# EAGLE design SONOff (EAGLE 7.6.0)
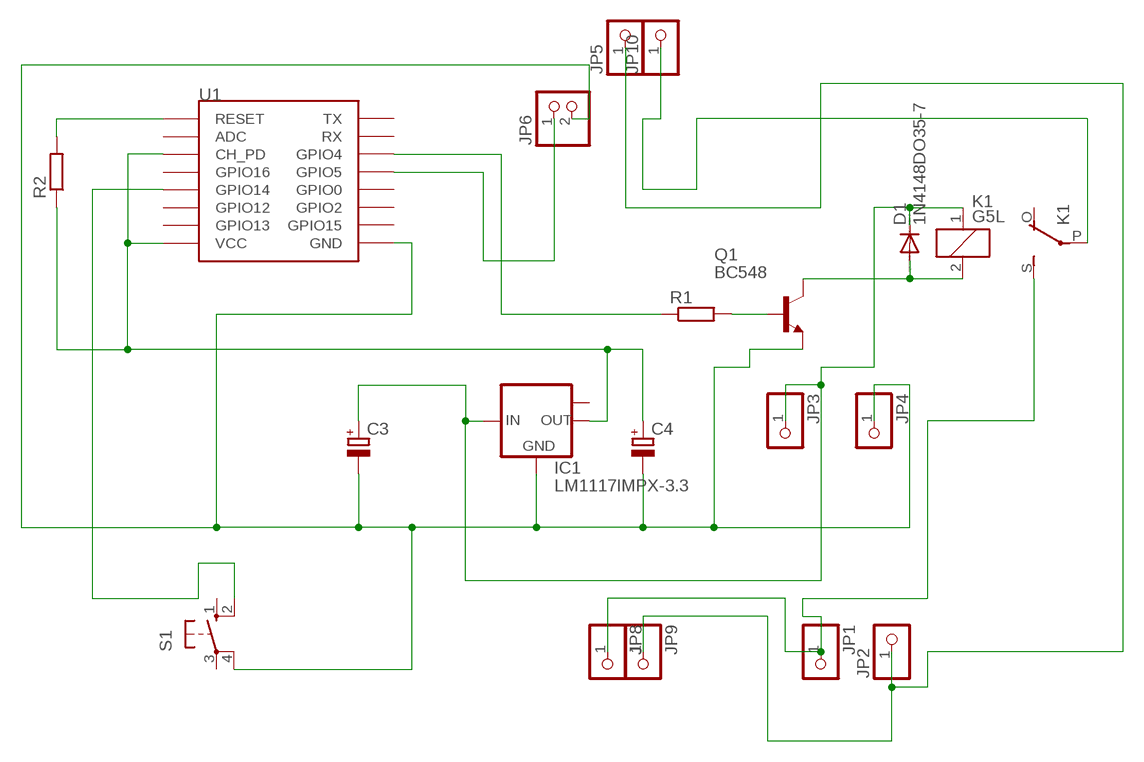
[diagram p0: schematic, sheet 1]

## Parts
C3  CPOL-EUE3.5-8  [E3,5-8]
C4  CPOL-EUE2.5-5  [E2,5-5]
D1  1N4148DO35-7  [DO35-7]
IC1  LM1117IMPX-3.3  [SOT223]
JP1  PINHD-1X1  [1X01]
JP2  PINHD-1X1  [1X01]
JP3  PINHD-1X1  [1X01]
JP4  PINHD-1X1  [1X01]
JP5  PINHD-1X1  [1X01]
JP6  PINHD-1X2  [1X02]
JP8  PINHD-1X1  [1X01]
JP9  PINHD-1X1  [1X01]
JP10  PINHD-1X1  [1X01]
K1  G5L  [G5LE]
Q1  BC548  [TO92-EBC]
R1  R-EU_0207/10  [0207/10]
R2  R-EU_0207/10  [0207/10]
S1  10-XX  [B3F-10XX]
U1  ESP12SMD  [ESP12-SMD]

## Nets
N$1: R1.1 U1.GPIO4
N$2: Q1.B R1.2
N$3: D1.A K1.2 Q1.C
N$4: C3.+ D1.C IC1.3(IN) JP3.1 K1.1
N$5: JP1.1 JP8.1 K1.S(2:S)
N$6: C4.+ IC1.2(OUT) R2.1 U1.CH_PD U1.VCC
N$7: JP2.1 JP5.1 JP9.1
N$9: JP6.1 U1.GPIO5
N$10: S1.2(S1) U1.GPIO14
N$11: R2.2 U1.RESET
N$12: C3.- C4.- IC1.1(GND) JP4.1 JP6.2 Q1.E S1.4(P1) U1.GND
SAIDA: JP10.1 K1.P(2:P)
Unconnected: IC1.TAB(OUT1) K1.O(2:O) S1.1(S) S1.3(P) U1.ADC U1.GPIO0 U1.GPIO2 U1.GPIO12 U1.GPIO13 U1.GPIO15 U1.GPIO16 U1.RXD0(RX) U1.TXD0(TX)

## Library data of the parts
C3 C4 = rcl:CPOL-EU: POLARIZED CAPACITOR, European symbol
D1 = diode:1N4148: DIODE high speed (Philips)
IC1 = lm1117:LM1117IMPX-*
JP1-JP5 JP8-JP10 = pinhead:PINHD-1X1: PIN HEADER
JP6 = pinhead:PINHD-1X2: PIN HEADER
K1 = relay:G5L: RELAY 1 x switch, 10 A/120 V AC, 8 A/30 V ADC, Omron; OC_FARNELL: unknown; OC_NEWARK: unknown
Q1 = transistor-npn:BC548*: NPN Transistor
R1 R2 = resistor:R-EU_: RESISTOR, European symbol
S1 = switch-omron:10-XX: OMRON SWITCH; MPN: B3F-1000; OC_FARNELL: 176432; OC_NEWARK: 36M3542
U1 = esp8266modules:ESP12: ESP8266 Wifi module 12

## Board
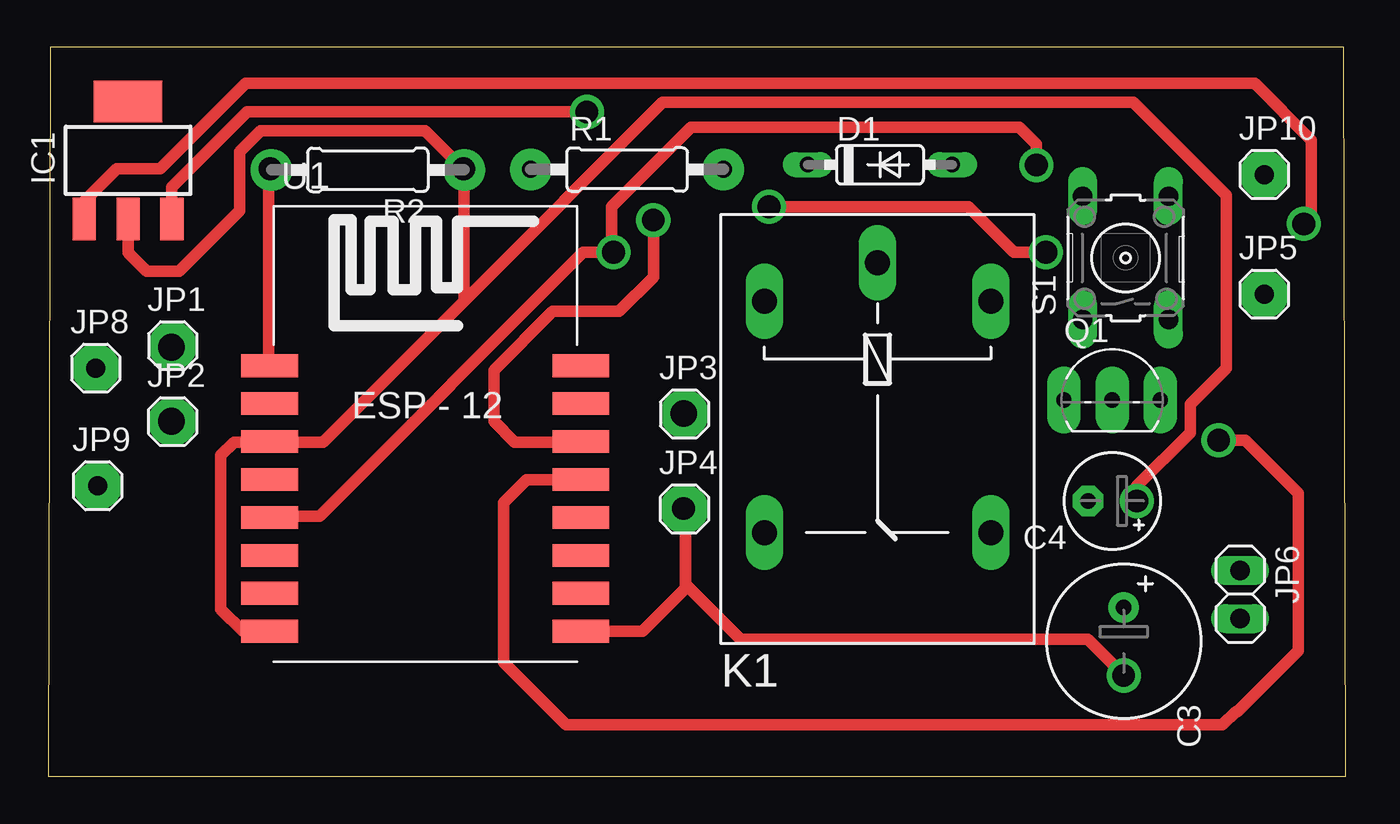
[diagram p1: board, top side]
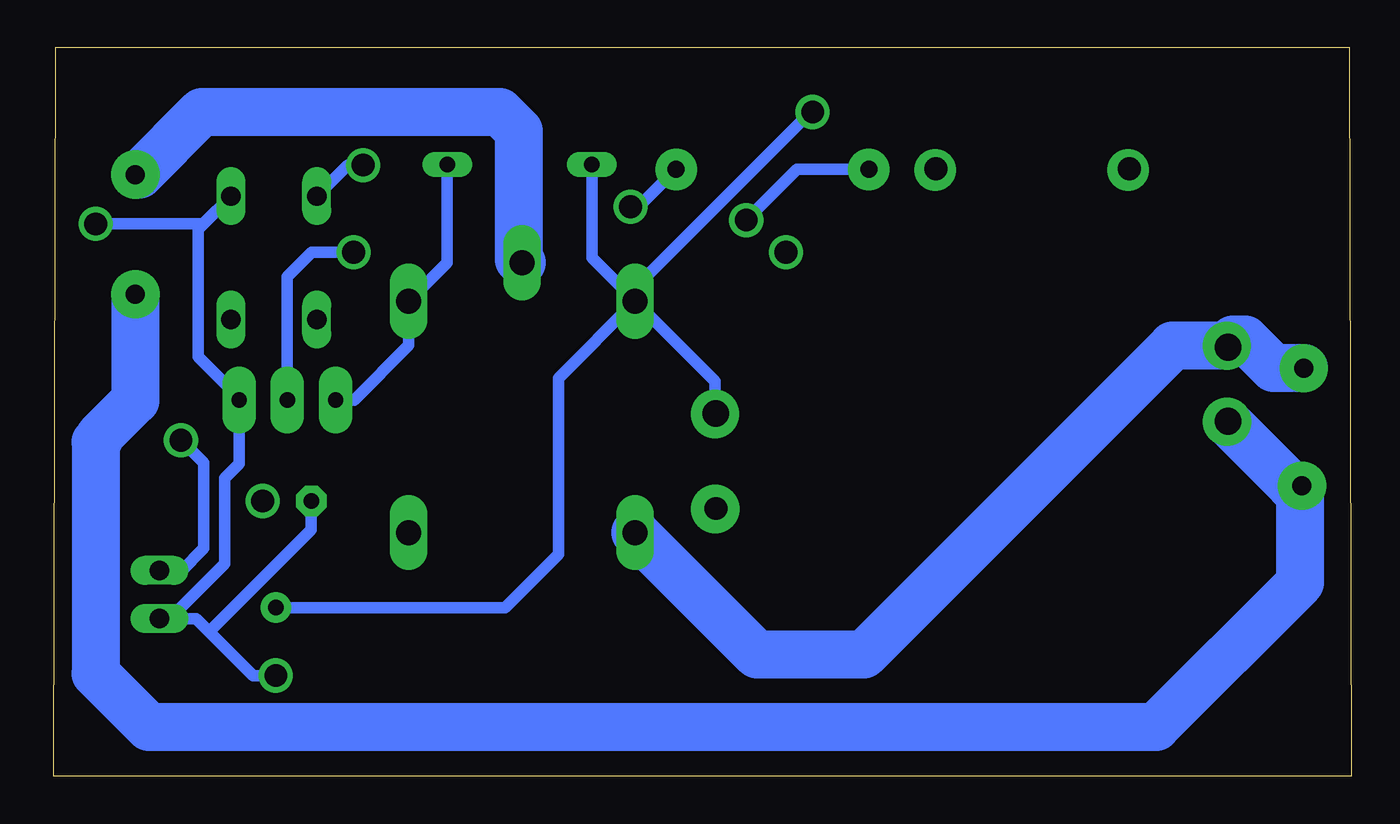
[diagram p2: board, bottom side, seen from below]

Size 68.4 x 38.4 mm. Coordinates in mm from the lower left corner, seen from the top.
Outline: 0,0 68.4,0 68.3,38.4 0.1,38.4 0,0
Copper layers (1*16): Top 0.035mm / dielectric 1.5mm / Bottom 0.035mm
Design rules "default": minimum track width 10mil, minimum drill 24mil, track to track 8mil, track to pad 8mil, pad to pad 8mil, via to via 8mil, smd to smd 8mil, copper to edge 40mil, drill to drill 8mil, minimum pad ring 10mil, minimum via ring 8mil, stop-mask expansion 4mil, vias tented up to drill 0mil, thermal gap 10mil

### Footprints (pad centres in the part's own frame; a part is rotated, then mirrored left to right if it is on the bottom)
E3,5-8 = drill 0.813 pad 1.6: + -1.778,0 | drill 0.813 pad 1.6 octagon: - 1.778,0
E2,5-5 = drill 0.813 pad 1.6: + -1.27,0 | drill 0.813 pad 1.6 octagon: - 1.27,0
DO35-7 = drill 0.813 long: A 3.81,0; C -3.81,0
SOT223 = smd 1.219 x 2.235: 1 -2.311,-3.099; 2 0,-3.099; 3 2.311,-3.099 | smd 3.6 x 2.2: TAB 0,3.099
1X01 = drill 1 pad 2.54: 1 0,0
1X02 = drill 1.016 long: 1 -1.27,0; 2 1.27,0
G5LE = drill 1.321 long: 1 -7.493,-5.969; 2 -7.493,5.969; O 4.699,5.969; P -9.525,0; S 4.699,-5.969
TO92-EBC = drill 0.8 pad 1.778 long: B 0,-1.27; C -2.54,-1.27; E 2.54,-1.27
0207/10 = drill 0.9 pad 2.184: 1 -5.08,0; 2 5.08,0
B3F-10XX = drill 1.016 long: 1 -3.251,2.261; 2 3.251,2.261; 3 -3.251,-2.261; 4 3.251,-2.261
ESP12-SMD = smd 3 x 1.2: ADC -8.3,3.8; CH_PD -8.3,1.8; GND 8.1,-8.2; GPIO0 8.1,-2.2; GPIO2 8.1,-4.2; GPIO4 8.1,1.8; GPIO5 8.1,-0.2; GPIO12 -8.3,-4.2; GPIO13 -8.3,-6.2; GPIO14 -8.3,-2.2; GPIO15 8.1,-6.2; GPIO16 -8.3,-0.2; RESET -8.3,5.8; RXD0 8.1,3.8; TXD0 8.1,5.8; VCC -8.3,-8.2

### Placement (x,y rotation side)
C3  56.7,7.1 270 top
C4  56.1,14.5 180 top
D1  43.85,32.22 0 top
IC1  4.21,32.45 0 top
JP1  6.56,22.68 0 top
JP2  6.55,18.68 0 top
JP3  33.54,19.08 0 top
JP4  33.53,14.08 0 top
JP5  64.1,25.4 0 top
JP6  62.84,9.57 270 top
JP8  2.5,21.5 0 top
JP9  2.6,15.3 0 top
JP10  64.1,31.7 0 top
K1  43.72,17.53 270 top
Q1  56.09,21.09 0 top
R1  30.52,31.97 0 top
R2  16.85,31.95 180 top
S1  56.8,27.31 90 top
U1  19.98,15.83 0 top

### Tracks (layer width: path | path; a pad name or v marks a point on that pad's centre or on a via)
N$1  (via drill 1.2)
  Top 0.61: v31.9,29.3 31.9,26.3 30.1,24.5 26.6,24.5 23.5,21.4 23.5,18.7 24.6,17.6 28.05,17.6 U1.GPIO4
  Bottom 0.61: R1.1 29.23,31.97 v31.9,29.3
N$2  (via drill 1.2)
  Top 0.61: v52.6,27.6 50.9,27.6 48.5,30 v38,30
  Bottom 0.61: Q1.B 56.09,26.31 54.8,27.6 v52.6,27.6 | v38,30 37.57,30 R1.2
N$3
  Bottom 0.61: D1.A 47.66,27.05 K1.2 49.7,22.7 52.58,19.82 Q1.C
N$4  (via drill 1.2 pad 0.25)
  Top 0.61: v28.4,35 10.5,35 6.52,31.02 IC1.3
  Bottom 0.61: D1.C 40.04,27.31 38.11,25.39 | 38.11,25.39 K1.1 | C3.+ 44.62,8.88 41.8,11.7 41.8,20.97 K1.1 | JP3.1 33.54,20.81 K1.1 | v28.4,35 28.5,35 38.11,25.39
N$5
  Bottom 2.54: JP8.1 4.1,21.5 5.6,23 6.24,23 JP1.1 9.42,22.68 25.7,6.4 31.32,6.4 K1.S
N$6
  Top 0.61: 21.93,25.03 R2.1 19.88,34 11.2,34 10.1,32.9 10.1,29.8 6.9,26.6 5.2,26.6 4.21,27.59 IC1.2 | 21.93,25.03 14.5,17.6 11.71,17.6 U1.CH_PD 11.65,17.6 9.8,17.6 9.1,16.9 9.1,8.8 10.27,7.63 U1.VCC | C4.+ 57.37,15.27 60.2,18.1 60.2,19.6 62.1,21.5 62.1,30.6 57.2,35.5 32.4,35.5 21.93,25.03
N$7
  Bottom 2.54: JP2.1 3.17,15.3 JP9.1 2.7,15.2 2.7,10.2 10.3,2.6 63.4,2.6 66.2,5.4 66.2,17.6 66,17.8 66,17.9 64.1,19.8 JP5.1
N$8  (via drill 1.2 pad 0.25)
  other vias: 33.5,14.1
N$9  (via drill 1.2)
  Top 0.61: U1.GPIO5 25.23,15.63 24,14.4 24,6 27.3,2.7 61.9,2.7 62.6,3.4 62.7,3.4 65.9,6.6 65.9,14.9 63.1,17.7 v61.7,17.7
  Bottom 0.61: JP6.1 62.8,10.8 61.7,10.8 60.5,12 60.5,16.5 v61.7,17.7
N$10  (via drill 1.2)
  Top 0.61: U1.GPIO14 11.75,13.7 14.3,13.7 28.2,27.6 v29.8,27.6 29.7,27.7 29.7,30 33.9,34.2 51.2,34.2 52.1,33.3 v52.1,32.2
  Bottom 0.61: v52.1,32.2 52.9,32.2 S1.2
N$11
  Top 0.61: U1.RESET 11.61,21.7 11.61,31.79 R2.2
N$12  (via drill 1.2 pad 0.25)
  Top 0.61: U1.GND 31.33,7.63 33.6,9.9 33.6,10.1 | JP4.1 33.6,14.31 33.6,10.1 | IC1.1 1.9,30.3 3.6,32 5.9,32 10.4,36.5 63.6,36.5 66.6,33.5 66.6,29.5 v66.2,29.1 | 33.6,10.1 36.5,7.2 54.82,7.2 C3.-
  Bottom 0.61: JP6.2 62.3,8.3 | 62.3,8.3 60.9,8.3 60.2,7.6 | 60.2,7.6 57.9,5.3 56.72,5.3 C3.- | C4.- 54.83,12.97 60.2,7.6 | 62.3,8.3 59.4,11.2 59.4,15.7 58.63,16.47 Q1.E 58.63,19.93 60.8,22.1 60.8,28.82 S1.4 60.52,29.1 v66.2,29.1
N$13  (via drill 1.2 pad 0.25)
  other vias: 57.4,14.5
N$14  (via drill 1.2 pad 0.25)
  other vias: 11.7,32
N$15  (via drill 1.2 pad 0.25)
  other vias: 56.7,5.3
N$16  (via drill 1.2 pad 0.25)
  other vias: 21.9,32
N$17  (via drill 1.4 pad 0.3)
  other vias: 6.5,22.6
N$18  (via drill 1.4 pad 0.3)
  other vias: 6.5,18.7
N$19  (via drill 1.4 pad 0.3)
  other vias: 33.5,19.1
SAIDA
  Bottom 2.54: JP10.1 63.9,31.7 60.6,35 44.9,35 43.9,34 43.9,27.23 K1.P